# Altium schematic sheet screen.SchDoc
size A4; SheetNumber: 4; SheetTotal: 4
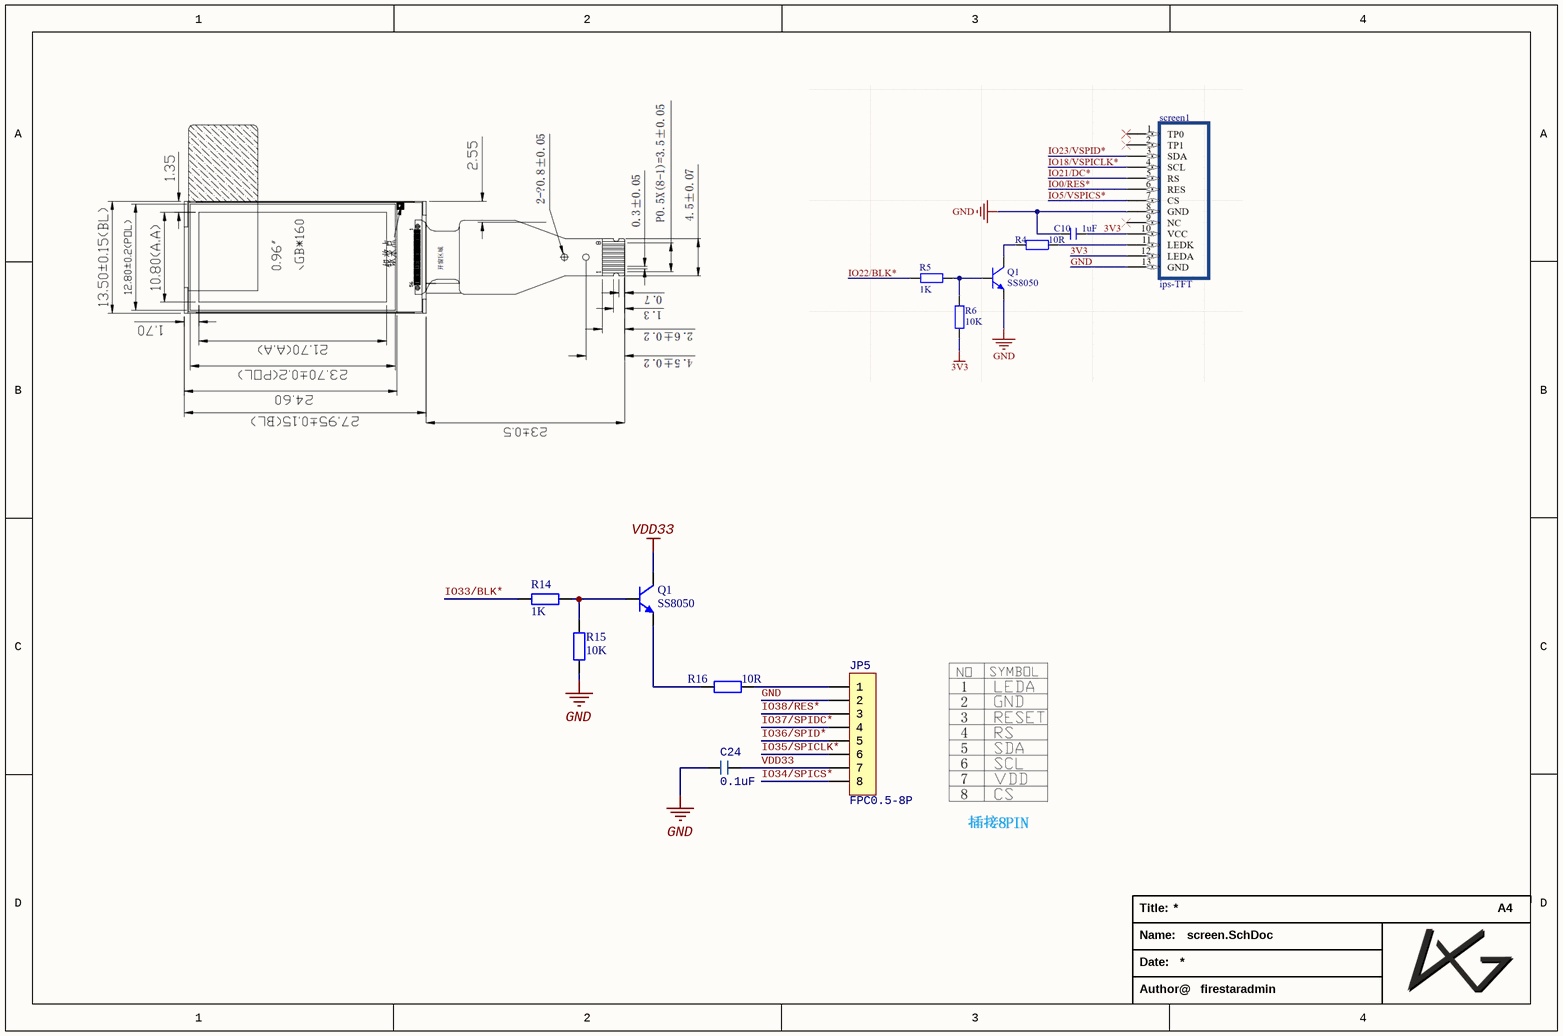
[diagram p0: screen.SchDoc]

## Parts
C24  0.1uF  [C 0603_L]
JP5  FPC0.5-8P  [FPC0.5 2H-WS-8P]
Q1  SS8050  [SOT23-3L]
R14  1K  [R 0603_L]
R15  10K  [R 0603_L]
R16  10R  [R 0603_L]

## Nets
GND: C24.1 JP5.2 R15.1
VDD33: C24.2 JP5.7 Q1.3(C)
IO33/BLK*: R14.2
IO34/SPICS*: JP5.8
IO35/SPICLK*: JP5.6
IO36/SPID*: JP5.5
IO37/SPIDC*: JP5.4
IO38/RES*: JP5.3
NetJP5_1: JP5.1 R16.1
NetQ1_1: Q1.1(B) R14.1 R15.2
NetQ1_2: Q1.2(E) R16.2

## Notes on the sheet
- Title:
- A4
- Name:
- Date:
- Author@
- firestaradmin

## Library data of the parts
C24 = C: 无极性贴片电容; 版权归属: 源创客; BOM名称: 无极性贴片电容; 学习资源: www.ooocke.com
JP5 = FPC-8P: FPC连接器; 版权归属: 源创客; BOM名称: FPC连接器; 学习资源: www.ooocke.com
Q1 = 8050-SMD: 高频放大-NPN型; 版权归属: 源创客; 属性: 40V 1.5A 1W 100MHZ; BOM名称: 高频放大-NPN型; 学习资源: www.ooocke.com
R14-R16 = R: 贴片电阻; 版权归属: 源创客; BOM名称: 贴片电阻; 学习资源: www.ooocke.com